# Altium schematic sheet CanSat Communication.SchDoc
size A1; SheetNumber: 1; SheetTotal: 1
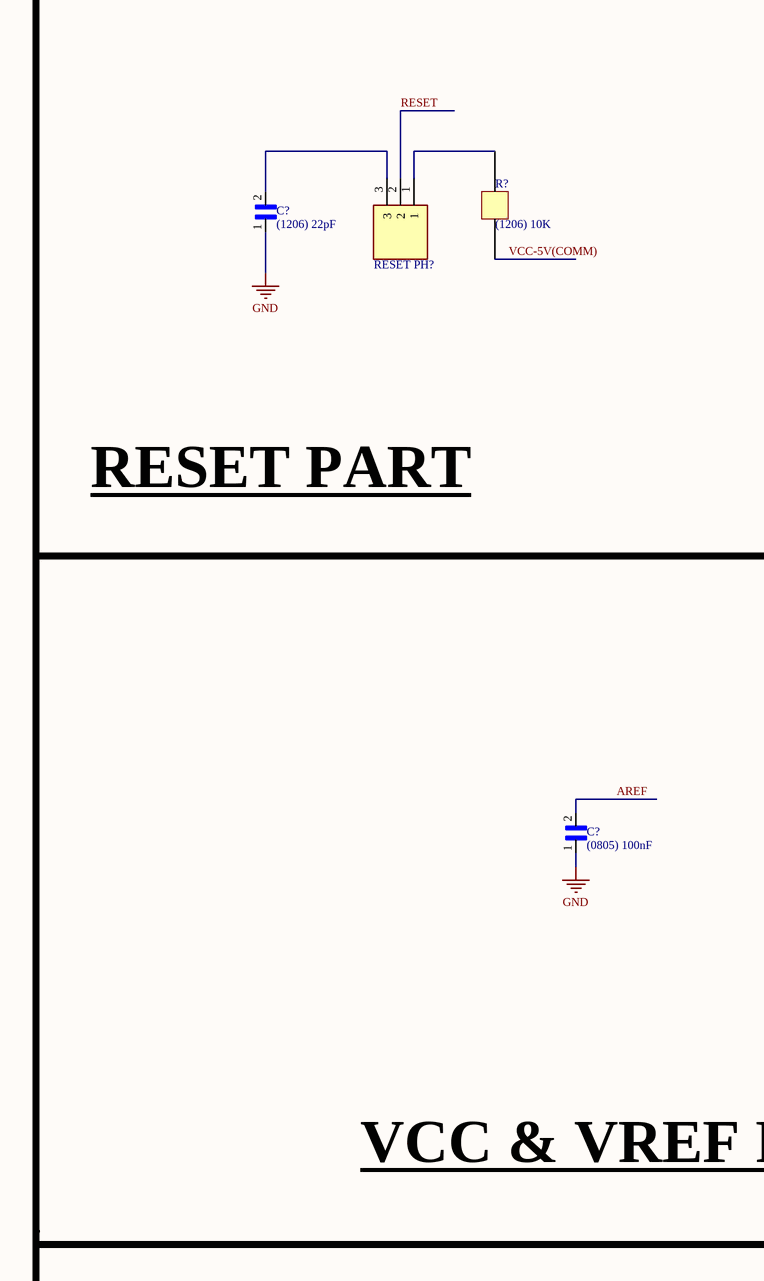
[diagram p0: CanSat Communication.SchDoc, top left]
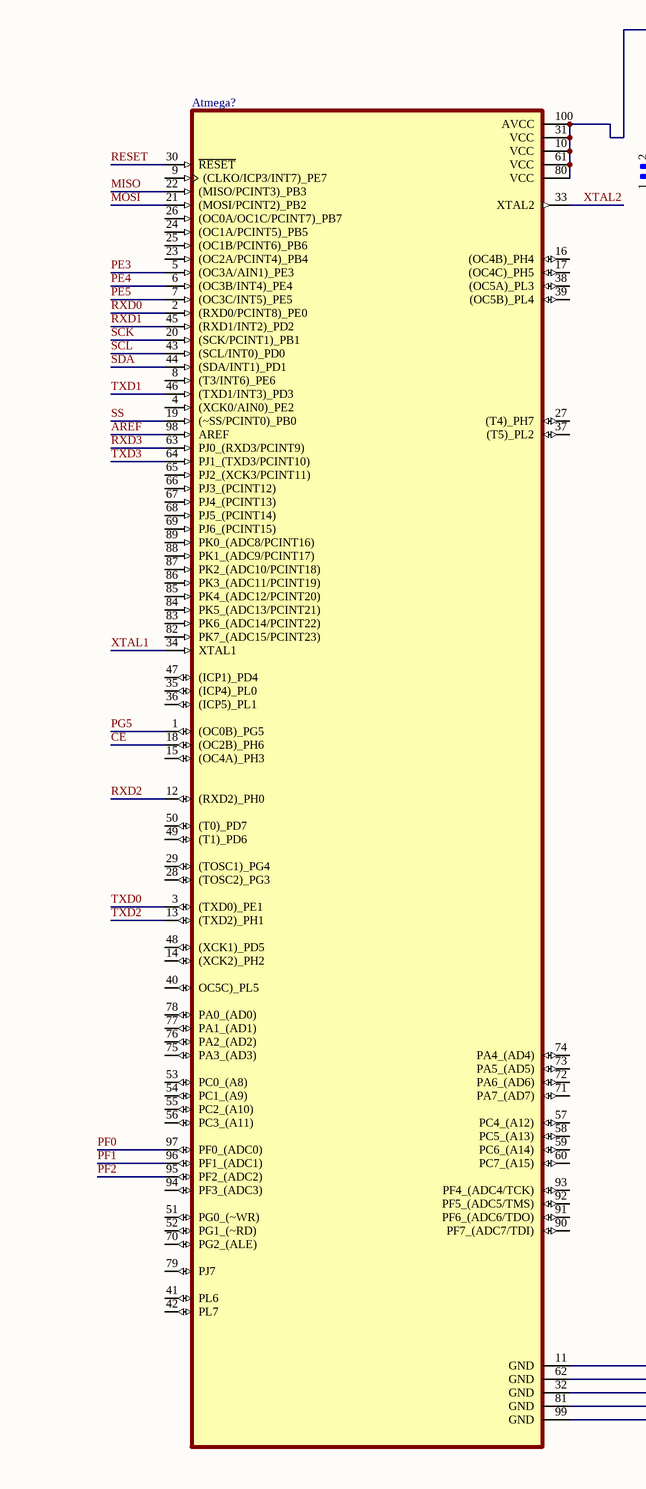
[diagram p1: CanSat Communication.SchDoc, top middle]
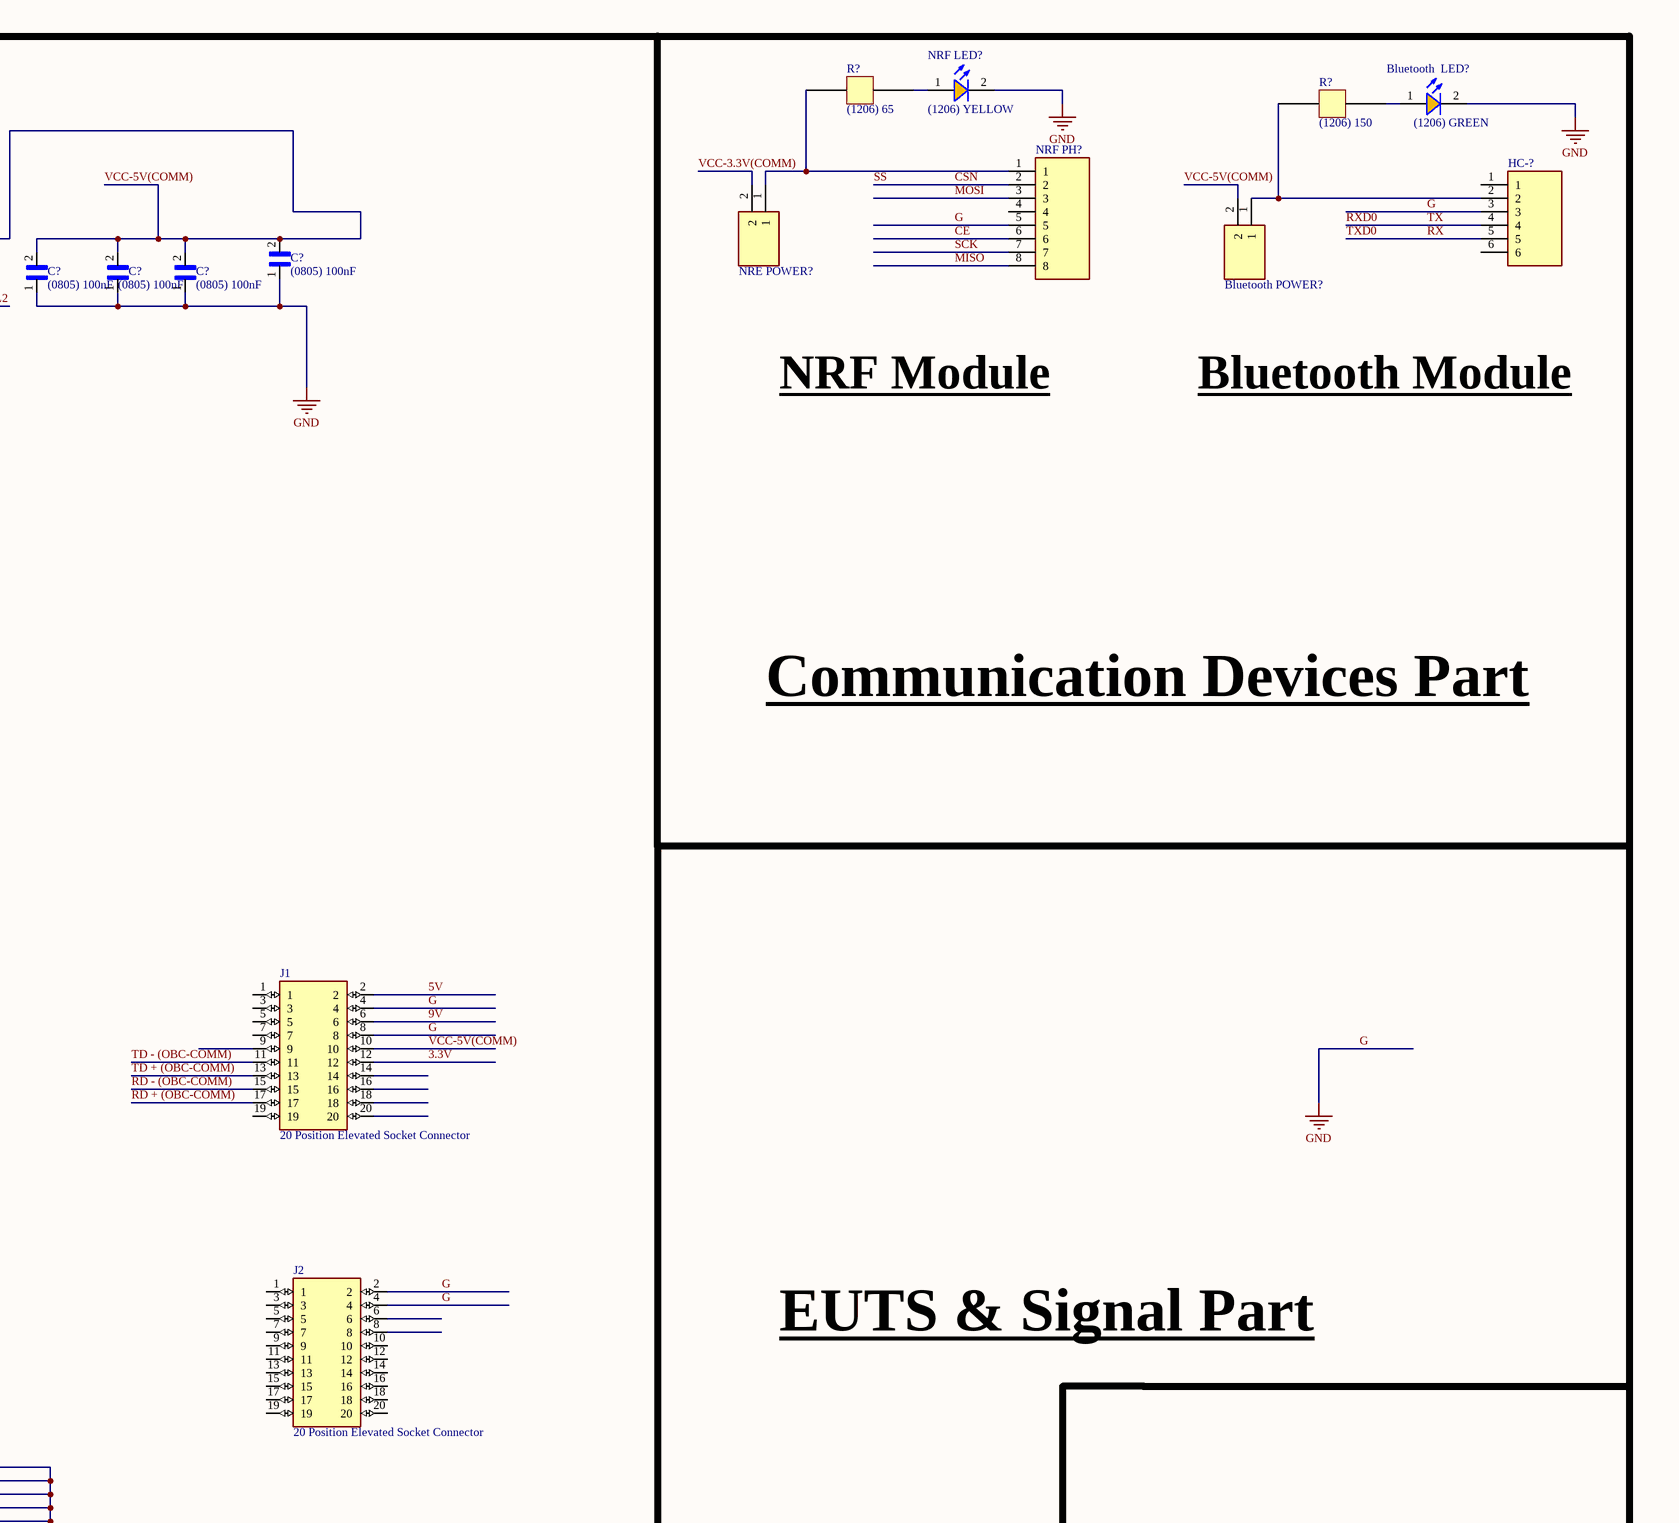
[diagram p2: CanSat Communication.SchDoc, top right]
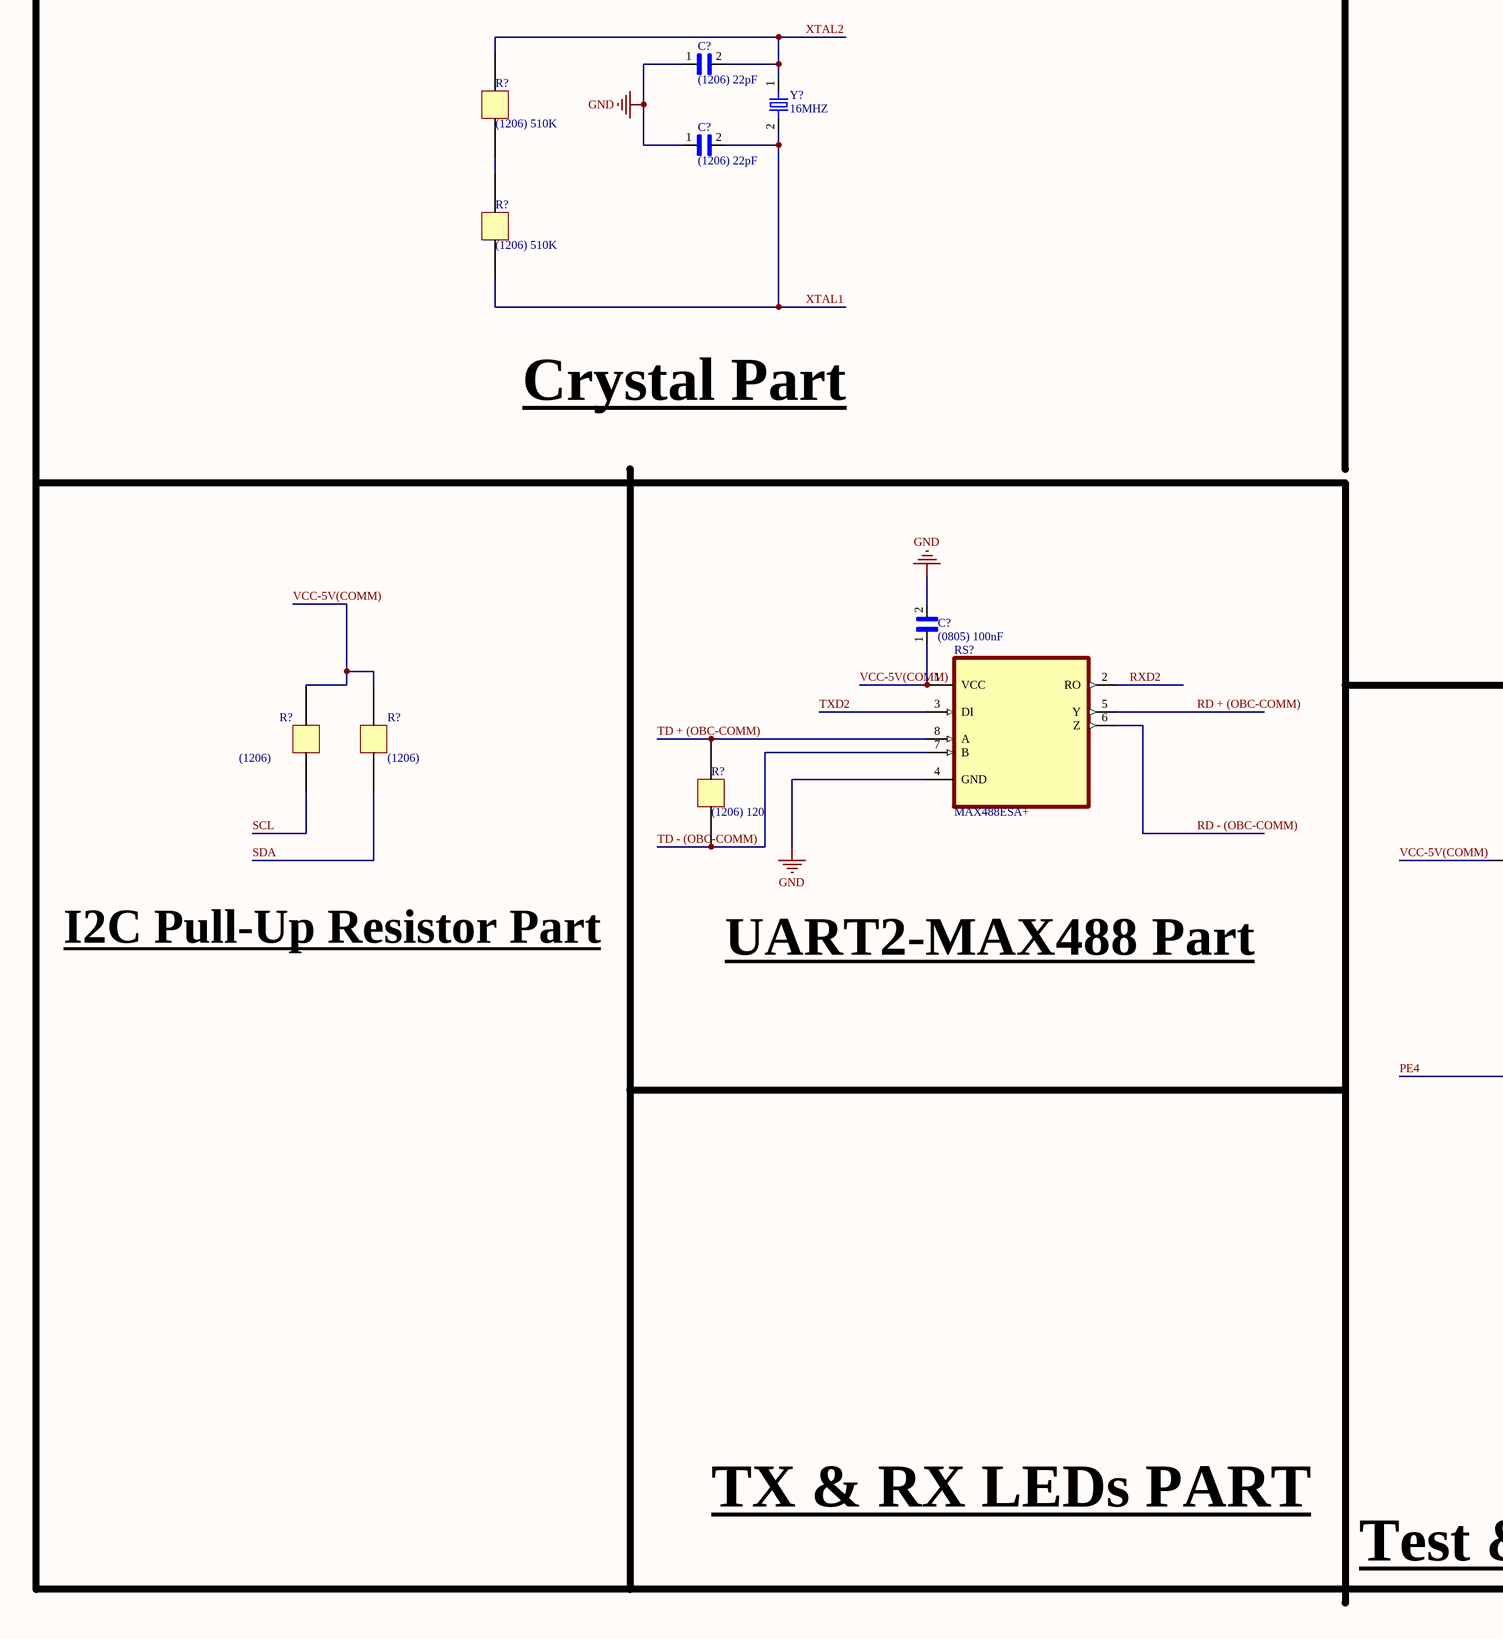
[diagram p3: CanSat Communication.SchDoc, bottom left]
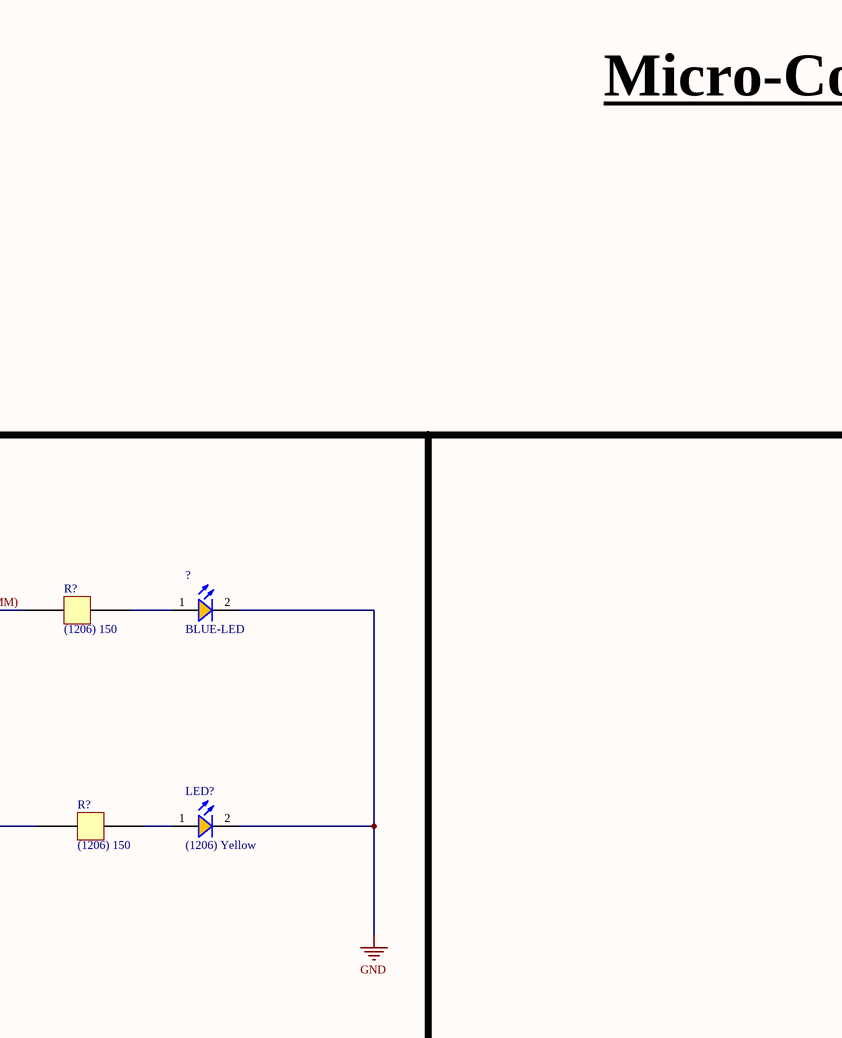
[diagram p4: CanSat Communication.SchDoc, bottom middle]
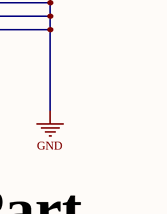
[diagram p5: CanSat Communication.SchDoc, bottom right]

## Parts
(Parts that share a designator on the sheet are numbered #1, #2 ... from top to bottom, then left to right.)
?  BLUE-LED  [RESC3015X65-01]
Atmega?  (no value)  [QFP50P1600X1600X120-100N]
Bluetooth_LED?  (1206) GREEN  [RESC3015X65-01]
Bluetooth_POWER?  2 Position PinHeader  [TE_2-103327-2]  (value not drawn)
C?#1  (0805) 100nF  [CAPC2012X95N-0]
C?#2  (0805) 100nF  [CAPC2012X95N-0]
C?#3  (0805) 100nF  [CAPC2012X95N-0]
C?#4  (0805) 100nF  [CAPC2012X95N-0]
C?#5  (1206) 22pF  [CAPC3216X125N0]
C?#6  (0805) 100nF  [CAPC2012X95N-0]
C?#7  (1206) 22pF  [CAPC3216X125N0]
C?#8  (1206) 22pF  [CAPC3216X125N0]
C?#9  (0805) 100nF  [CAPC2012X95N-0]
HC-?  6 Position PinHeader 1Row  [TE_6-146285-6]  (value not drawn)
J1  20 Position Elevated Socket Connector  [ESQ-110-XX-X-D]
J2  20 Position Elevated Socket Connector  [ESQ-110-XX-X-D]
LED?  (1206) Yellow  [RESC3015X65-01]
NRE_POWER?  2 Position PinHeader  [TE_2-103327-2]  (value not drawn)
NRF_LED?  (1206) YELLOW  [RESC3015X65-01]
NRF_PH?  8 Position PinHeader 2Row  [TE_8-146256-8]  (value not drawn)
R?#1  (1206) 65  [CAPC3216X125N0]
R?#2  (1206) 150  [CAPC3216X125N0]
R?#3  (1206) 10K  [CAPC3216X125N0]
R?#4  (1206) 510K  [CAPC3216X125N0]
R?#5  (1206) 510K  [CAPC3216X125N0]
R?#6  (1206)  [CAPC3216X125N0]
R?#7  (1206)  [CAPC3216X125N0]
R?#8  (1206) 120  [CAPC3216X125N0]
R?#9  (1206) 150  [CAPC3216X125N0]
R?#10  (1206) 150  [CAPC3216X125N0]
RESET_PH?  3 Position PinHeader 1Row  [TE_3-103327-3]  (value not drawn)
RS?  MAX488ESA+  [SOIC127P600X175-8N0]
Y?  16MHZ  [XTAL1140X490X430N-0]

## Nets
G: ?.2(K) Atmega?.11(GND) Atmega?.32(GND) Atmega?.62(GND) Atmega?.81(GND) Atmega?.99(GND) Bluetooth_LED?.2(K) C?#1.1 C?#2.1 C?#3.1 C?#4.1 C?#5.1 C?#6.1 C?#7.1 C?#8.1 C?#9.2 HC-?.3 J1.4 J1.8 J2.2 J2.4 LED?.2(K) NRF_LED?.2(K) NRF_PH?.5 RS?.4(GND)  [also labelled GND]
3.3V: J1.12
5V: J1.2
9V: J1.6
AREF: Atmega?.98(AREF) C?#6.2
CE: Atmega?.18((OC2B)_PH6) NRF_PH?.6
CSN: Atmega?.19((~SS/PCINT0)_PB0) NRF_PH?.2  [also labelled SS]
MISO: Atmega?.22((MISO/PCINT3)_PB3) NRF_PH?.8
MOSI: Atmega?.21((MOSI/PCINT2)_PB2) NRF_PH?.3
PE3: Atmega?.5((OC3A/AIN1)_PE3)
PE4: Atmega?.6((OC3B/INT4)_PE4) R?#10.1
PE5: Atmega?.7((OC3C/INT5)_PE5)
PF0: Atmega?.97(PF0_(ADC0))
PF1: Atmega?.96(PF1_(ADC1))
PF2: Atmega?.95(PF2_(ADC2))
PG5: Atmega?.1((OC0B)_PG5)
RD + (OBC-COMM): J1.17 RS?.5(Y)
RD - (OBC-COMM): J1.15 RS?.6(Z)
RESET: Atmega?.30(~{RESET}) RESET_PH?.2
RX: Atmega?.3((TXD0)_PE1) HC-?.5  [also labelled TXD0]
RXD0: Atmega?.2((RXD0/PCINT8)_PE0) HC-?.4  [also labelled TX]
RXD1: Atmega?.45((RXD1/INT2)_PD2)
RXD2: Atmega?.12((RXD2)_PH0) RS?.2(RO)
RXD3: Atmega?.63(PJ0_(RXD3/PCINT9))
SCK: Atmega?.20((SCK/PCINT1)_PB1) NRF_PH?.7
SCL: Atmega?.43((SCL/INT0)_PD0) R?#6.2
SDA: Atmega?.44((SDA/INT1)_PD1) R?#7.2
TD + (OBC-COMM): J1.13 R?#8.2 RS?.8(A)
TD - (OBC-COMM): J1.11 R?#8.1 RS?.7(B)
TXD1: Atmega?.46((TXD1/INT3)_PD3)
TXD2: Atmega?.13((TXD2)_PH1) RS?.3(DI)
TXD3: Atmega?.64(PJ1_(TXD3/PCINT10))
VCC-3.3V(COMM): NRE_POWER?.2
VCC-5V(COMM): Atmega?.10(VCC) Atmega?.31(VCC) Atmega?.61(VCC) Atmega?.80(VCC) Atmega?.100(AVCC) Bluetooth_POWER?.2 C?#1.2 C?#2.2 C?#3.2 C?#4.2 C?#9.1 J1.10 R?#3.1 R?#6.1 R?#7.1 R?#9.1 RS?.1(VCC)
XTAL1: Atmega?.34(XTAL1) C?#8.2 R?#5.1 Y?.2
XTAL2: Atmega?.33(XTAL2) C?#7.2 R?#4.2 Y?.1
Net?_1: ?.1(A) R?#9.2
NetBluetooth_LED?_1: Bluetooth_LED?.1(A) R?#2.2
NetBluetooth_POWER?_1: Bluetooth_POWER?.1 HC-?.2 R?#2.1
NetC?#5_2: C?#5.2 RESET_PH?.3
NetLED?_1: LED?.1(A) R?#10.2
NetNRE_POWER?_1: NRE_POWER?.1 NRF_PH?.1 R?#1.1
NetNRF_LED?_1: NRF_LED?.1(A) R?#1.2
NetR?#3_2: R?#3.2 RESET_PH?.1
NetR?#4_1: R?#4.1 R?#5.2

Not connected (* = marked no-connect by the designer): Atmega? 4((XCK0/AIN0)_PE2) 8((T3/INT6)_PE6) 9((CLKO/ICP3/INT7)_PE7) 14((XCK2)_PH2) 15((OC4A)_PH3) 16((OC4B)_PH4) 17((OC4C)_PH5) 23((OC2A/PCINT4)_PB4) 24((OC1A/PCINT5)_PB5) 25((OC1B/PCINT6)_PB6) 26((OC0A/OC1C/PCINT7)_PB7) 27((T4)_PH7) 28((TOSC2)_PG3) 29((TOSC1)_PG4) 35((ICP4)_PL0) 36((ICP5)_PL1) 37((T5)_PL2) 38((OC5A)_PL3) 39((OC5B)_PL4) 40(OC5C)_PL5) 41(PL6) 42(PL7) 47((ICP1)_PD4) 48((XCK1)_PD5) 49((T1)_PD6) 50((T0)_PD7) 51(PG0_(~WR)) 52(PG1_(~RD)) 53(PC0_(A8)) 54(PC1_(A9)) 55(PC2_(A10)) 56(PC3_(A11)) 57(PC4_(A12)) 58(PC5_(A13)) 59(PC6_(A14)) 60(PC7_(A15)) 65(PJ2_(XCK3/PCINT11)) 66(PJ3_(PCINT12)) 67(PJ4_(PCINT13)) 68(PJ5_(PCINT14)) 69(PJ6_(PCINT15)) 70(PG2_(ALE)) 71(PA7_(AD7)) 72(PA6_(AD6)) 73(PA5_(AD5)) 74(PA4_(AD4)) 75(PA3_(AD3)) 76(PA2_(AD2)) 77(PA1_(AD1)) 78(PA0_(AD0)) 79(PJ7) 82(PK7_(ADC15/PCINT23)) 83(PK6_(ADC14/PCINT22)) 84(PK5_(ADC13/PCINT21)) 85(PK4_(ADC12/PCINT20)) 86(PK3_(ADC11/PCINT19)) 87(PK2_(ADC10/PCINT18)) 88(PK1_(ADC9/PCINT17)) 89(PK0_(ADC8/PCINT16)) 90(PF7_(ADC7/TDI)) 91(PF6_(ADC6/TDO)) 92(PF5_(ADC5/TMS)) 93(PF4_(ADC4/TCK)) 94(PF3_(ADC3)); HC-? 1 6; J1 1 3 5 7 9 14 16 18 19 20; J2 1 3 5 6 7 8 9 10 11 12 13 14 15 16 17 18 19 20; NRF_PH? 4

## Notes on the sheet
- NRF Module
- Bluetooth Module
- RESET PART
- Communication Devices Part
- VCC & VREF PART
- EUTS & Signal Part
- Micro-Controller Part
- Crystal Part
- I2C Pull-Up Resistor Part
- UART2-MAX488 Part
- TX & RX LEDs PART
- Test & Power LEDs

## Library data of the parts
? Bluetooth_LED? LED? NRF_LED? = LED 1206: LED SMD 1206 High Quality Forward Voltage: 3.2 V / Brightness: 700 mcd; Manufacturer: Wurth Elektronik; Manufacturer Part Number: 150060AS75003; Chip Technology: AlInGaP; Dominant Wavelength: 605nm; Emitting Color: Amber; Forward Voltage: 2V; Luminous Intensity: 350mcd; Peak Wavelength: 610nm; Viewing Angle: 140°; ComponentLink1Description: Manufacturer Link; ComponentLink1URL: http://www.we-online.de; ComponentLink2Description: Datasheet; ComponentLink2URL: https://www.we-online.com/catalog/datasheet/150060AS75003.pdf; Height: 0.7mm; Length: 1.6mm; Mounting Technology: SMT; Operating Temperature max.: 100C; Operating Temperature min.: -40C; Packaging: Tape and Reel; Size: 0603; Width: 0.8mm
Atmega? = ATMEGA2560-16AU: Value: *; MP: ATMEGA2560-16AU; Package: None; Availability: Unavailable; Price: None
Bluetooth_POWER? NRE_POWER? = 2 Position PinHeader: Cabezal del conector Agujero pasante 2 posiciones 0,100 (2,54 mm); MP: 4-103327-4; MF: TE Connectivity; SnapEDA_Link: https://www.snapeda.com/parts/4-103327-4/TE%20Connectivity%20AMP%20Connectors/view-part/2403998/?ref=snap; Purchase-URL: https://pricing.snapeda.com/search/part/4-103327-4/?ref=eda; Value: *; Package: None; EU_RoHS_Compliance: Compliant; Price: None; Availability: Warning; Check_prices: https://www.snapeda.com/parts/4-103327-4/TE%20Connectivity%20AMP%20Connectors/view-part/2403998/?ref=eda
C?#1-C?#4 C?#6 C?#9 = Capacitor 0805: UMK212SD103KD-T/CAP CER 10000PF 50V 0805; Package: None; Price: None; Value: *; MP: UMK212SD103KD-T; Availability: Unavailable
C?#5 C?#7 C?#8 = Capacitor 1206: UMF316B7103KFHT/1206 Capacitor; Package: None; Price: None; Value: *; MP: UMF316B7103KFHT; Availability: Unavailable
HC-? = 6 Position PinHeader 1Row: Connector Header Through Hole 6 position 0.100 (2.54mm); MP: 5-146285-6; MF: TE Connectivity; DigiKey-Purchase-URL: https://snapeda.com/shop?store=DigiKey&id=2411669; EU_RoHS_Compliance: Compliant; Package: None; Value: *; SnapEDA_Link: https://www.snapeda.com/parts/5-146285-6/TE%20Connectivity%20AMP%20Connectors/view-part/2411669/?ref=snap; Digi-Key_Part_Number: A122872-ND
J1 J2 = 20 Position Elevated Socket Connector: 20 Position Elevated Socket Connector Through Hole; MP: ESQ-110-14-T-D; MF: Samtec; Package: None; SnapEDA_Link: https://www.snapeda.com/parts/ESQ-110-14-T-D/Samtec%20Inc./view-part/786056/?ref=snap; Value: *; Availability: Unavailable; Price: None
NRF_PH? = 8 Position PinHeader 2Row: 08 MODII HDR DRST B/A .100CL LF; MP: 5-146256-4; MF: TE Connectivity; Package: None; Availability: Unavailable; Value: *; Price: None; SnapEDA_Link: https://www.snapeda.com/parts/5-146256-4/TE%20Connectivity%20AMP%20Connectors/view-part/500529/?ref=snap
R?#1-R?#10 = Resistor 1206
RESET_PH? = 3 Position PinHeader 1Row: Conn Unshrouded Header HDR 3 POS 2.54mm Solder ST Thru-Hole Carton; MF: TE Connectivity; MP: 4-103327-5; Package: None; Value: *; TE_purchase_URL: https://www.te.com/usa-en/product-4-103327-5.html?te_bu=Cor&te_type=disp&te_campaign=seda_glo_cor-seda-global-disp-prtnr-fy19-seda-model-bom-cta_sma-317_1&elqCampaignId=32493; Price: None; SnapEDA_Link: https://www.snapeda.com/parts/4-103327-5/TE%20Connectivity%20AMP%20Connectors/view-part/2403997/?ref=snap; Availability: Unavailable; EU_RoHS_Compliance: Compliant
RS? = MAX488ESA+: 1/1 Transceiver Full RS422, RS485 8-SOIC; MP: MAX488ESA+T; MF: Maxim Integrated; Price: None; Package: SOIC-8 Maxim; Availability: Unavailable; SnapEDA_Link: https://www.snapeda.com/parts/MAX488ESA+T/Maxim%20Integrated/view-part/48834/?ref=snap; Value: *
Y? = Crystal 16MHZ